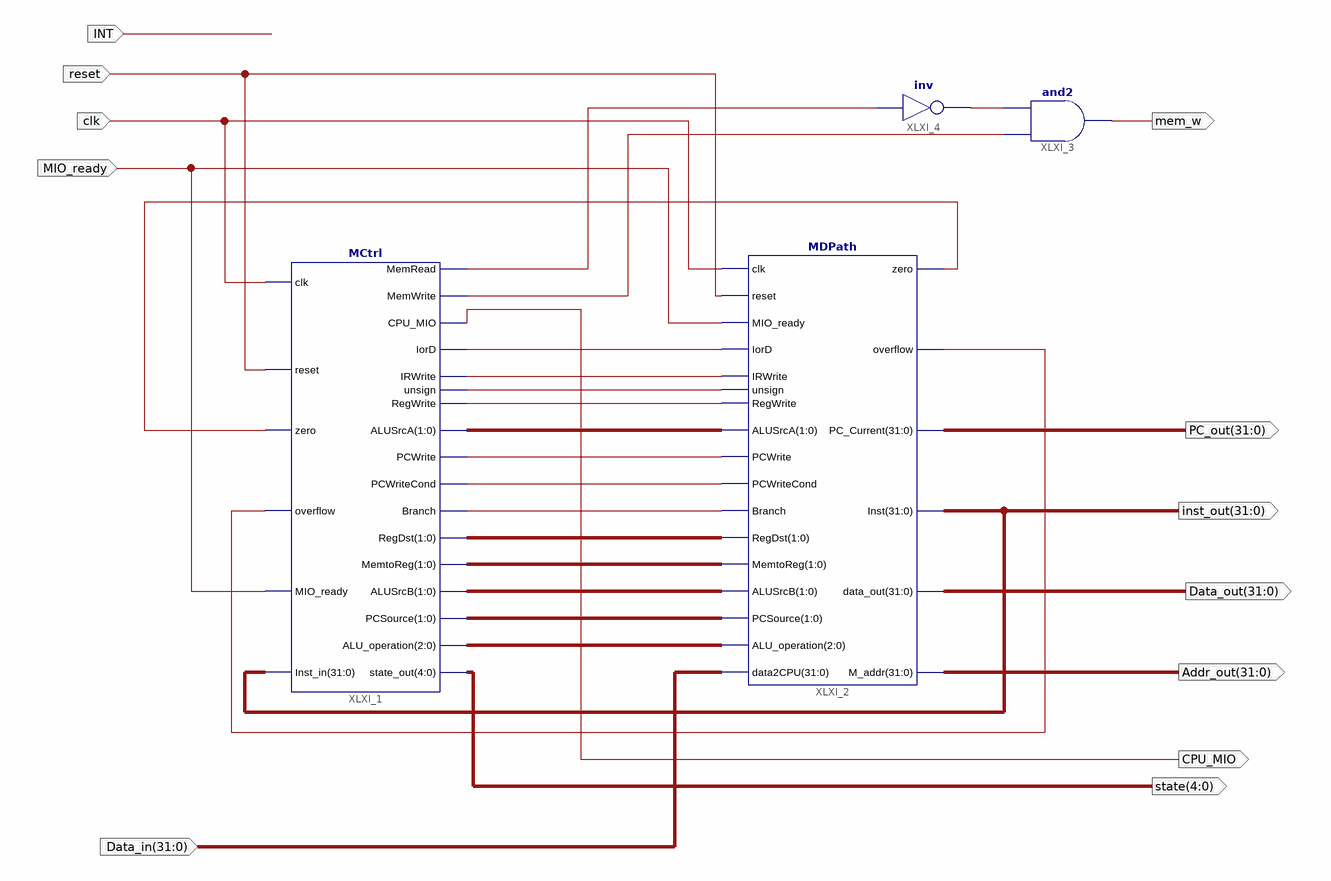
[diagram p0: schematic sheet 1]
// Xilinx ISE schematic MCPU.sch (kintex7) as structural Verilog: 4 symbols, 12 ports
module MCPU (
  input  [31:0] Data_in,
  input  MIO_ready,
  input  clk,
  input  reset,
  input  INT,
  output [4:0] state,
  output mem_w,
  output CPU_MIO,
  output [31:0] inst_out,
  output [31:0] PC_out,
  output [31:0] Data_out,
  output [31:0] Addr_out
);

  wire XLXN_1, XLXN_2, XLXN_3, XLXN_5, XLXN_6, XLXN_7, XLXN_21, XLXN_22, XLXN_23, XLXN_24, XLXN_31, XLXN_36;
  wire [1:0] XLXN_8, XLXN_9, XLXN_10, XLXN_11, XLXN_35;
  wire [2:0] XLXN_12;

  MCtrl XLXI_1 (
    .zero(XLXN_21), .overflow(XLXN_31), .MIO_ready(MIO_ready), .Inst_in(inst_out), .MemRead(XLXN_24),
    .MemWrite(XLXN_22), .CPU_MIO(CPU_MIO), .IorD(XLXN_1), .IRWrite(XLXN_2), .RegWrite(XLXN_3),
    .PCWrite(XLXN_5), .PCWriteCond(XLXN_6), .Branch(XLXN_7), .RegDst(XLXN_8), .MemtoReg(XLXN_9),
    .ALUSrcB(XLXN_10), .PCSource(XLXN_11), .ALU_operation(XLXN_12), .state_out(state), .reset(reset),
    .clk(clk), .ALUSrcA(XLXN_35), .unsign(XLXN_36));
  MDPath XLXI_2 (
    .clk(clk), .reset(reset), .MIO_ready(MIO_ready), .IorD(XLXN_1), .IRWrite(XLXN_2), .RegWrite(XLXN_3),
    .ALUSrcA(XLXN_35), .PCWrite(XLXN_5), .PCWriteCond(XLXN_6), .Branch(XLXN_7), .RegDst(XLXN_8),
    .MemtoReg(XLXN_9), .ALUSrcB(XLXN_10), .PCSource(XLXN_11), .ALU_operation(XLXN_12), .data2CPU(Data_in),
    .zero(XLXN_21), .overflow(XLXN_31), .PC_Current(PC_out), .Inst(inst_out), .data_out(Data_out),
    .M_addr(Addr_out), .unsign(XLXN_36));
  and XLXI_3 (mem_w, XLXN_22, XLXN_23);
  not XLXI_4 (XLXN_23, XLXN_24);
endmodule
